# EAGLE schematic logger_SMD_0603_v1 (EAGLE 7.5.0)

## Sheet 1 of 4
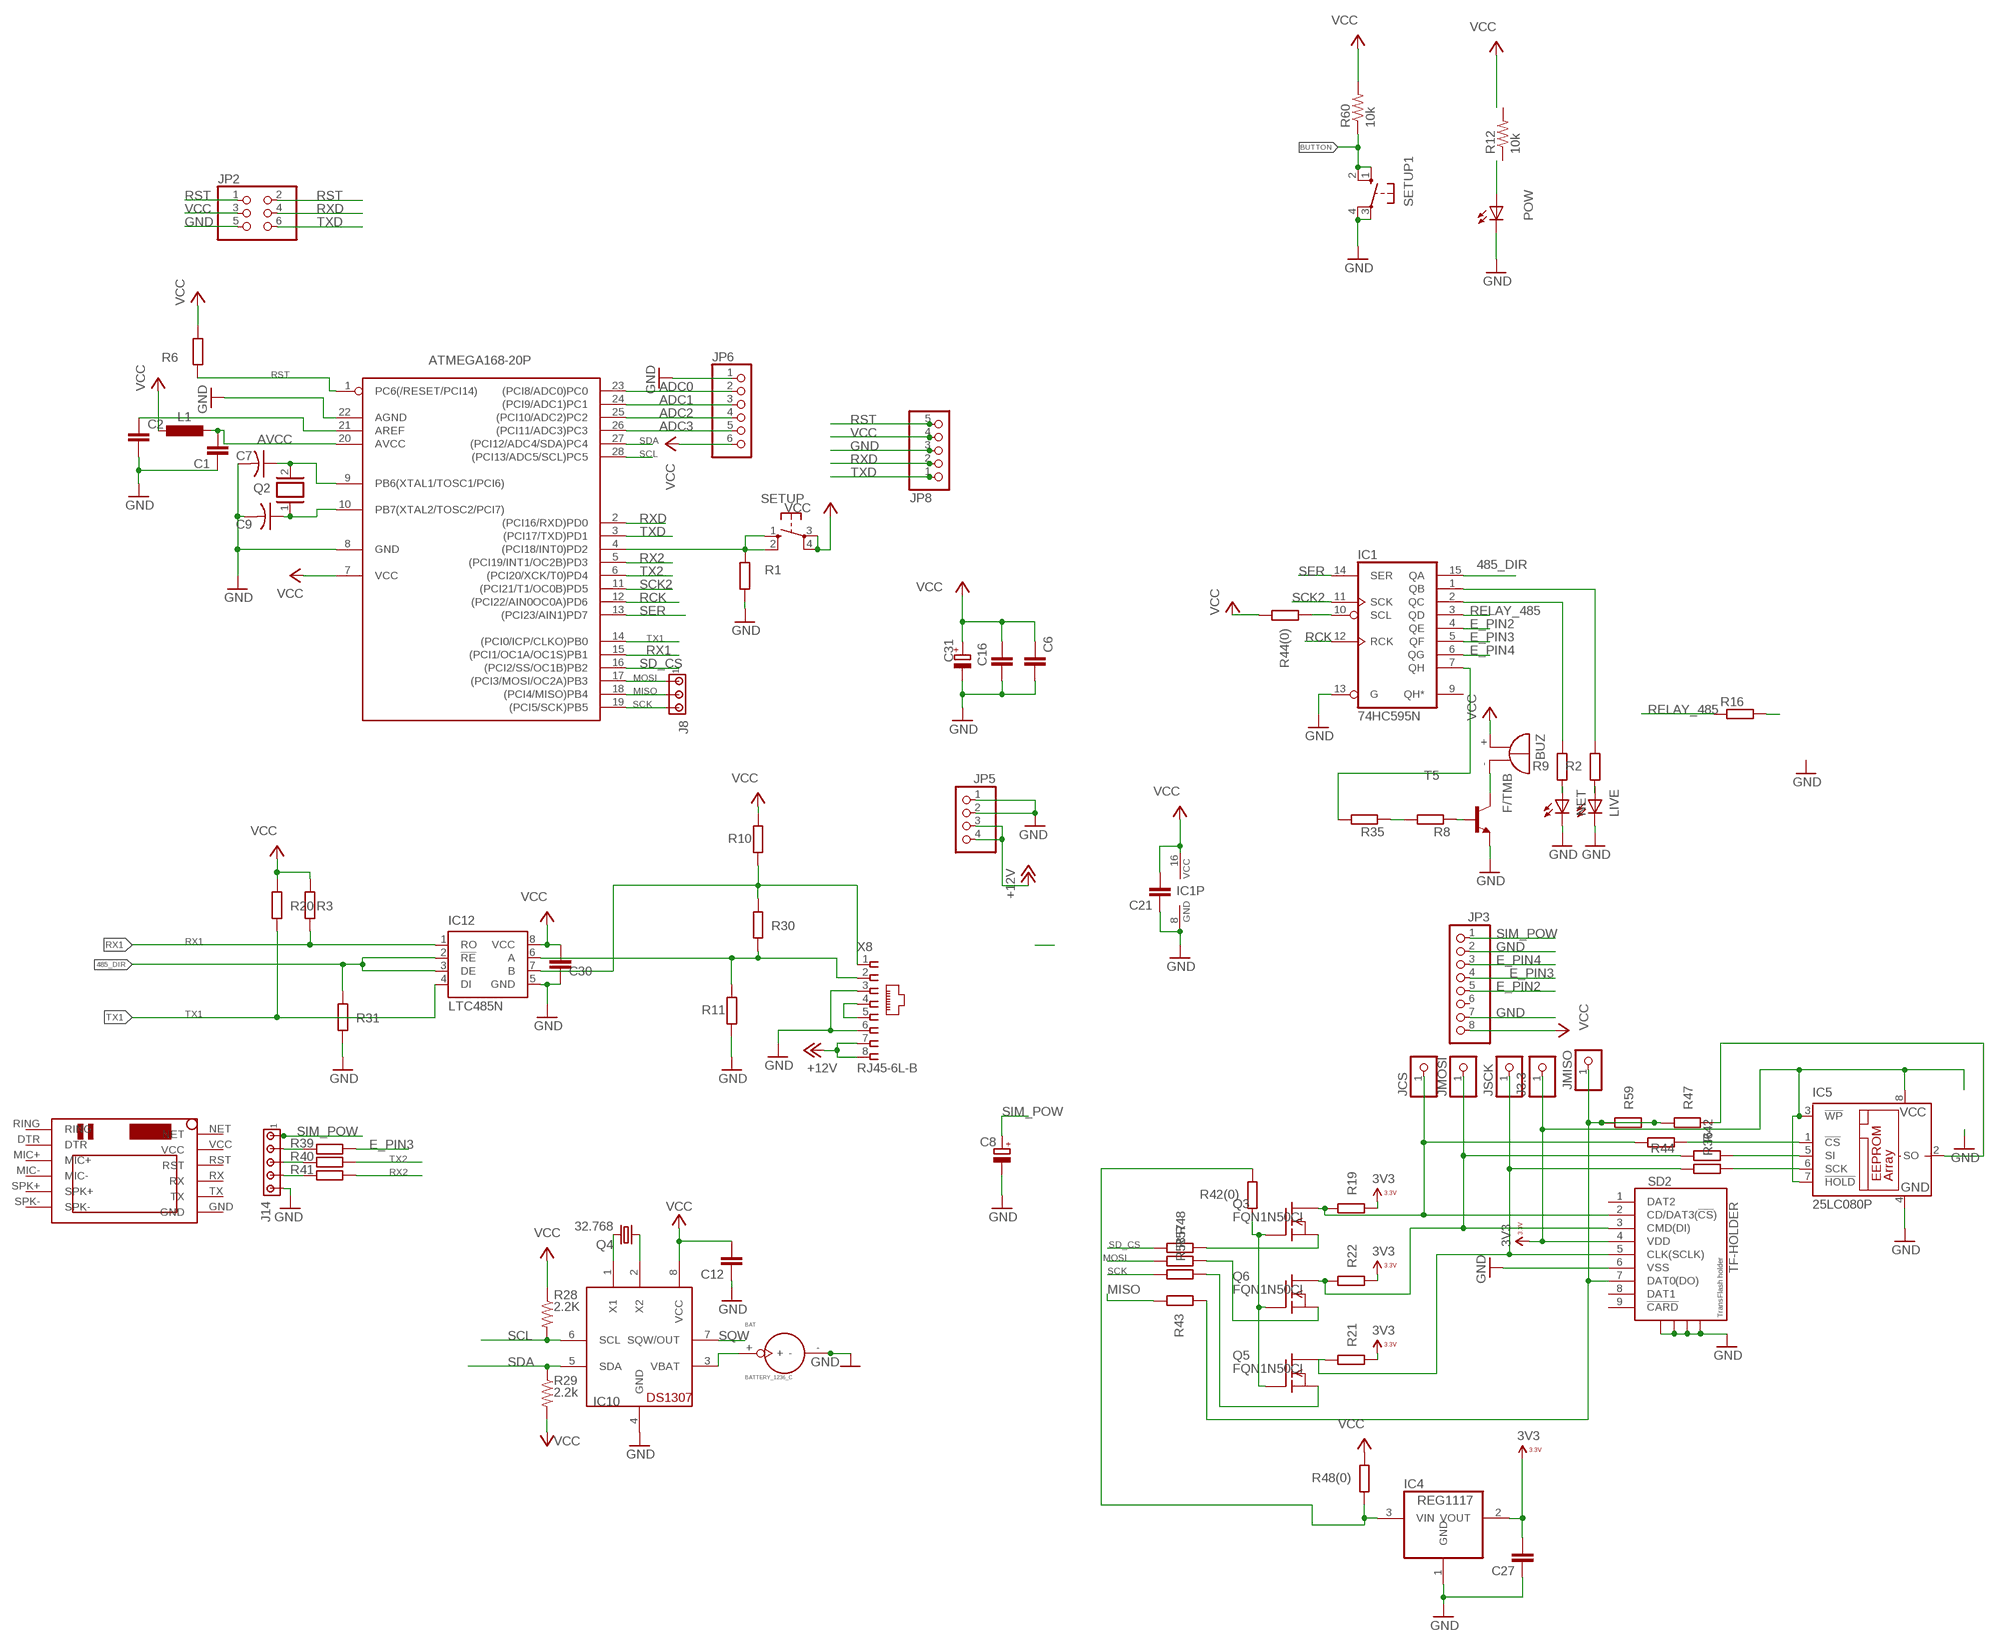
[diagram p0: schematic, sheet 1]

### Parts
BAT  BATTERY_1236_C  [BATTERY_1236_C]
BUZ  F/TMB  [F/TMB]
C1  C-EU050-024X044  [C050-024X044]
C2  C-EU025-025X050  [C025-025X050]
C6  C-EU025-025X050  [C025-025X050]
C7  C-US050-024X044  [C050-024X044]
C8  CPOL-EUE2.5-6  [E2,5-6]
C9  C-US050-024X044  [C050-024X044]
C12  C-EU075-032X103  [C075-032X103]
C16  C-EU050-024X044  [C050-024X044]
C21  C-EU050-024X044  [C050-024X044]
C27  C-EU050-024X044  [C050-024X044]
C30  C-EU050-024X044  [C050-024X044]
C31  CPOL-EUTT2D6  [TT2D6]
IC1  74HC595N  [DIL16]
IC4  REG1117  [SOT223]
IC5  25LC080P  [DIL8]
IC7  ATMEGA168-20P  [DIL28-3]
IC10  DS1307  [DIL08]
IC12  LTC485N  [DIL08]
J3.3  PINHD-1X1  [1X01]
J8  MTA03-100  [10X03MTA]
J14  MTA05-100  [10X05MTA]
JCS  PINHD-1X1  [1X01]
JMISO  PINHD-1X1  [1X01]
JMOSI  PINHD-1X1  [1X01]
JP2  PINHD-2X3  [2X03]
JP3  PINHD-1X8  [1X08]
JP5  PINHD-1X4  [1X04]
JP6  PINHD-1X6  [1X06]
JP8  PINHD-1X5/90  [1X05/90]
JSCK  PINHD-1X1  [1X01]
L1  L-EU0207/15  [0207/15]
LIVE  LED3MM  [LED3MM]
NET  LED3MM  [LED3MM]
POW  LED3MM  [LED3MM]
Q2  XTAL/S  [QS]
Q3  FQN1N50CI  [TO92-INLINE]
Q4  32.768  CRYTALTC38H  [TC38H]
Q5  FQN1N50CI  [TO92-INLINE]
Q6  FQN1N50CI  [TO92-INLINE]
R1  R-EU_0204/7  [0204/7]
R2  R-EU_0207/12  [0207/12]
R3  R-EU_0204/7  [0204/7]
R6  R-EU_0204/7  [0204/7]
R8  R-EU_0207/10  [0207/10]
R9  R-EU_0207/12  [0207/12]
R10  R-EU_0204/7  [0204/7]
R11  R-EU_0204/7  [0204/7]
R12  10k  R-US_R0805  [R0805]
R16  R-EU_0207/10  [0207/10]
R19  R-EU_0204/7  [0204/7]
R20  R-EU_0204/7  [0204/7]
R21  R-EU_0204/7  [0204/7]
R22  R-EU_0204/7  [0204/7]
R28  2.2K  R-US_0204/7  [0204/7]
R29  2.2k  R-US_0204/7  [0204/7]
R30  R-EU_0204/7  [0204/7]
R31  R-EU_0204/7  [0204/7]
R35  R-EU_0204/7  [0204/7]
R36  R-EU_0207/10  [0207/10]
R39  R-EU_0207/10  [0207/10]
R40  R-EU_0207/12  [0207/12]
R41  R-EU_0207/12  [0207/12]
R42  R-EU_0207/10  [0207/10]
R42(0)  R-EU_0207/10  [0207/10]
R43  R-EU_0204/7  [0204/7]
R44  R-EU_0207/10  [0207/10]
R44(0)  R-EU_0207/10  [0207/10]
R47  R-EU_0207/10  [0207/10]
R48  R-EU_0204/7  [0204/7]
R48(0)  R-EU_0207/10  [0207/10]
R57  R-EU_0204/7  [0204/7]
R58  R-EU_0204/7  [0204/7]
R59  R-EU_0204/7  [0204/7]
R60  10k  R-US_R0805  [R0805]
SD2  TF-HOLDER  [TF-PULL]
SETUP  10-XX  [B3F-10XX]
SETUP1  10-XX  [B3F-10XX]
T5  BC547A-NPN-TO92-CBE  [TO92-CBE]
U$1  SIM800LMODULE  [SIM800LMODULE]
X8  RJ45-6L-B  [RJ45-NO-SHIELD]

### Nets
3V3: C27.2 IC4.2(VOUT) IC5.3(!WP) IC5.7(!HOLD) IC5.8(VCC) J3.3.1 R19.2 R21.2 R22.2 SD2.4(VDD)
485_DIR: IC1.15(QA) IC12.2(!RE) IC12.3(DE) R31.1
+12V: JP5.3 JP5.4 X8.7 X8.8 ; also sheet 2
ADC0: IC7.23((PCI8/ADC0)PC0) JP6.2 ; also sheet 2
ADC1: IC7.24((PCI9/ADC1)PC1) JP6.3 ; also sheet 2
ADC2: IC7.25((PCI10/ADC2)PC2) JP6.4 ; also sheet 2
ADC3: IC7.26((PCI11/ADC3)PC3) JP6.5 ; also sheet 2
AVCC: C1.2 IC7.20(AVCC) L1.2
BUTTON: R60.1 SETUP1.1(S) SETUP1.2(S1)
E_PIN2: IC1.4(QE) JP3.5 ; also sheet 2
E_PIN3: IC1.5(QF) JP3.4 R39.1 ; also sheet 2
E_PIN4: IC1.6(QG) JP3.3 ; also sheet 2
GND: BAT.- C1.1 C2.1 C6.1 C7.2 C8.- C9.2 C12.1 C16.1 C21.1 C27.1 C30.1 C31.- IC1.8(GND) IC1.13(G) IC4.1(GND) IC5.4(GND) IC7.8(GND) IC7.22(AGND) IC10.4(GND) IC12.5(GND) J14.5 JP2.5 JP3.2 JP3.7 JP5.1 JP5.2 JP6.1 JP8.3 LIVE.K(C) NET.K(C) POW.K(C) R1.2 R11.1 R31.2 SD2.6(VSS) SD2.S1 SD2.S2 SD2.S3 SD2.S4 SETUP1.3(P) SETUP1.4(P1) T5.E X8.3 X8.6 ; also sheet 2
MISO: IC7.18((PCI4/MISO)PB4) J8.2 R43.2
MISOIHU: JMISO.1 R43.1 R47.1 R59.1 R59.2 SD2.7(DAT0(DO))
MOSI: IC7.17((PCI3/MOSI/OC2A)PB3) J8.1 Q6.3(S) R57.1 R57.2
N$1: LIVE.A R2.1
N$2: IC1.1(QB) R2.2
N$3: X8.4 X8.5
N$4: C2.2 IC7.21(AREF)
N$9: IC4.3(VIN) R42(0).2 R48(0).1
N$10: R8.1 T5.B
N$11: R16.2
N$14: NET.A R9.1
N$16: IC7.4((PCI18/INT0)PD2) R1.1 SETUP.1(S) SETUP.2(S1)
N$17: IC1.2(QC) R9.2
N$18: IC1.7(QH) R35.2
N$19: J14.2 R39.2
N$21: C7.1 IC7.9(PB6(XTAL1/TOSC1/PCI6)) Q2.2
N$22: C9.1 IC7.10(PB7(XTAL2/TOSC2/PCI7)) Q2.1
N$30: POW.A
N$33: JSCK.1 Q5.1(D) R21.1 R36.1 SD2.5(CLK(SCLK))
N$34: JMOSI.1 Q6.1(D) R22.1 R42.1 SD2.3(CMD(DI))
N$35: IC5.5(SI) R42.2
N$37: IC5.6(SCK) R36.2
N$38: J14.3 R40.2
N$44: IC5.1(!CS) R44.2
N$45: J14.4 R41.2
N$46: Q3.2(G) Q5.2(G) Q6.2(G) R42(0).1
N$47: IC1.10(SCL) R44(0).1
N$48: IC5.2(SO) R47.2
N$50: IC10.1(X1) Q4.2
N$51: IC10.2(X2) Q4.1
N$52: BAT.+ IC10.3(VBAT)
N$53: JCS.1 Q3.1(D) R19.1 R44.1 SD2.2(CD/DAT3(!CS!))
N$57: BUZ.- T5.C
N$58: R8.2 R35.1
RCK: IC1.12(RCK) IC7.12((PCI22/AIN0OC0A)PD6)
RELAY_485: IC1.3(QD) R16.1
RST: IC7.1(PC6(/RESET/PCI14)) JP2.1 JP2.2 JP8.5 R6.1
RX1: IC7.15((PCI1/OC1A/OC1S)PB1) IC12.1(RO) R3.2
RX2: IC7.5((PCI19/INT1/OC2B)PD3) R41.1
RXD: IC7.2((PCI16/RXD)PD0) JP2.4 JP8.2
SCK: IC7.19((PCI5/SCK)PB5) J8.3 Q5.3(S) R58.1 R58.2
SCK2: IC1.11(SCK) IC7.11((PCI21/T1/OC0B)PD5)
SCL: IC7.28((PCI13/ADC5/SCL)PC5) IC10.6(SCL) R28.2
SD_CS: IC7.16((PCI2/SS/OC1B)PB2) Q3.3(S) R48.1 R48.2
SDA: IC7.27((PCI12/ADC4/SDA)PC4) IC10.5(SDA) R29.1
SER: IC1.14(SER) IC7.13((PCI23/AIN1)PD7)
SIM_POW: C8.+ J14.1 JP3.1 ; also sheet 2
SQW: IC10.7(SQW/OUT)
TX1: IC7.14((PCI0/ICP/CLKO)PB0) IC12.4(DI) R20.2
TX2: IC7.6((PCI20/XCK/T0)PD4) R40.1
TX+2: IC12.7(B) R10.1 R30.1 X8.1
TX-2: IC12.6(A) R11.2 R30.2 X8.2
TXD: IC7.3((PCI17/TXD)PD1) JP2.6 JP8.1
VCC: BUZ.+ C6.2 C12.2 C16.2 C21.2 C30.2 C31.+ IC1.16(VCC) IC7.7(VCC) IC10.8(VCC) IC12.8(VCC) JP2.3 JP3.8 JP6.6 JP8.4 L1.1 R3.1 R6.2 R10.2 R20.1 R28.1 R29.2 R44(0).2 R48(0).2 R60.2 SETUP.3(P) SETUP.4(P1) ; also sheet 2
Unconnected: IC1.9(QH*) JP3.6 R12.1 R12.2 SD2.1(DAT2) SD2.8(DAT1) SD2.9(!CARD) U$1.DTR U$1.GND U$1.MIC+ U$1.MIC- U$1.NET U$1.RING U$1.RST U$1.RX U$1.SPK+ U$1.SPK- U$1.TX U$1.VCC

## Sheet 2 of 4
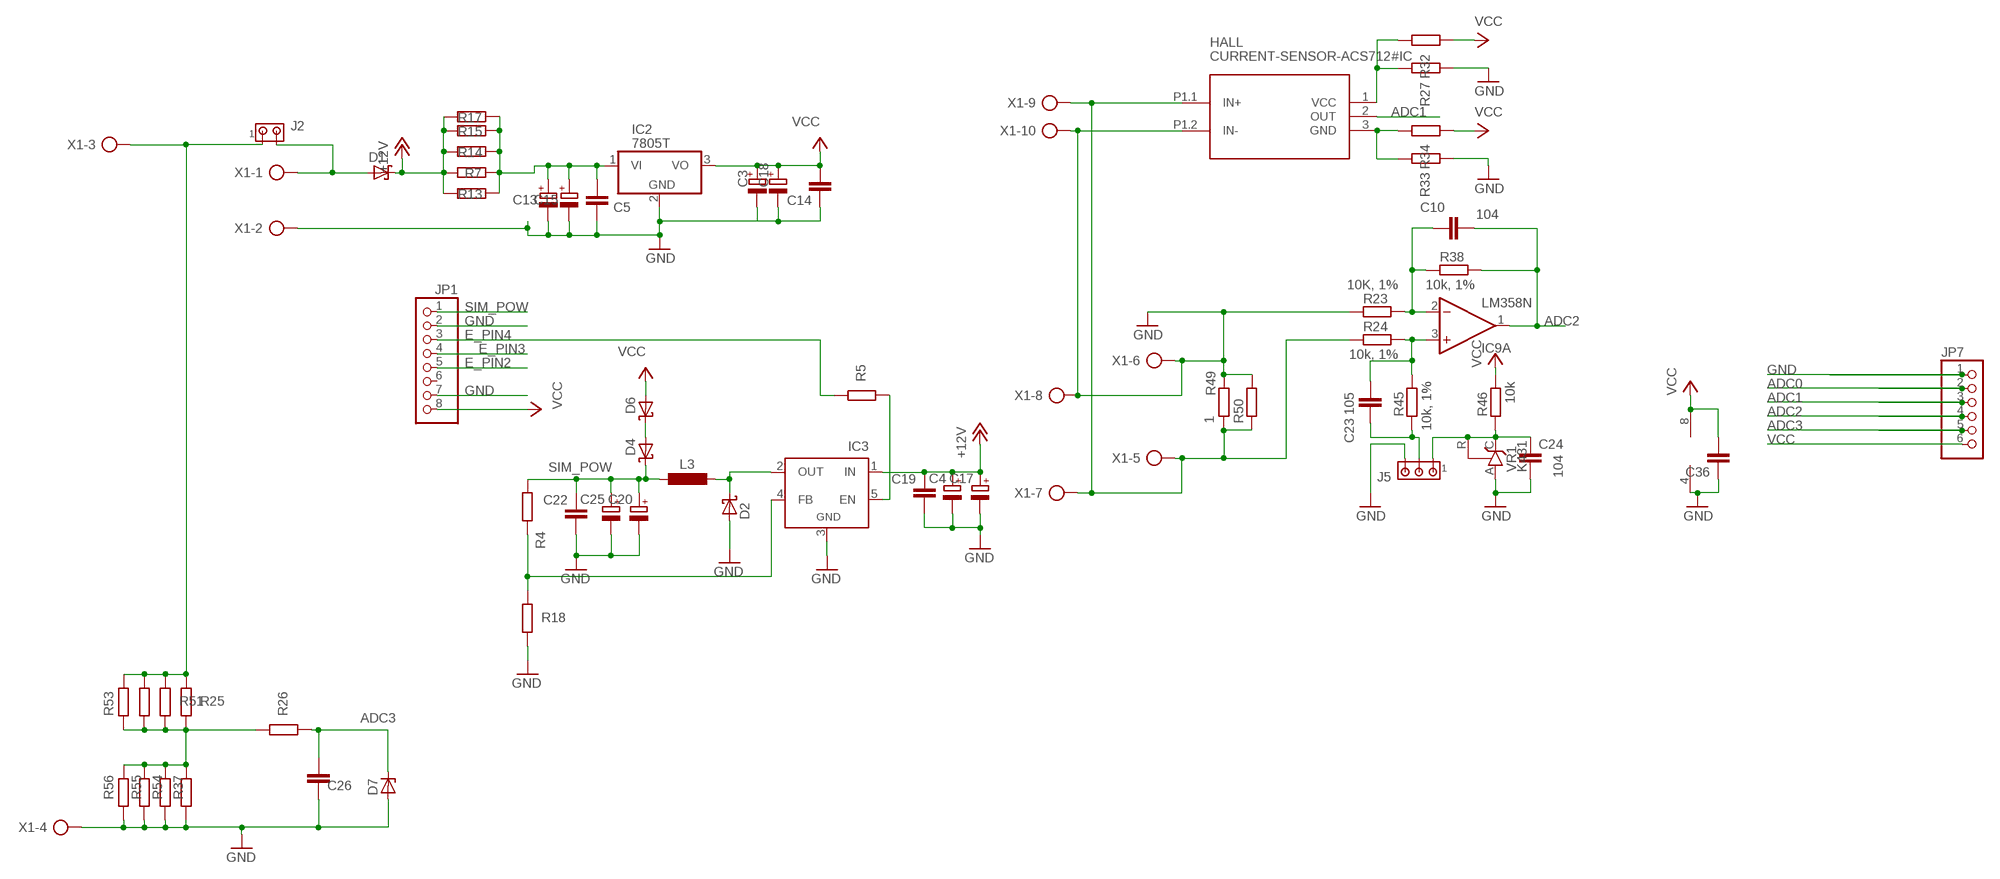
[diagram p1: schematic, sheet 2]

### Parts
C3  CPOL-EUTT2D6  [TT2D6]
C4  CPOL-EUE2.5-6  [E2,5-6]
C5  C-EU050-024X044  [C050-024X044]
C10  104  C-EU050-024X044  [C050-024X044]
C13  CPOL-EUTT2D6  [TT2D6]
C14  C-EU050-024X044  [C050-024X044]
C15  CPOL-EUTT2D6  [TT2D6]
C17  CPOL-EUE2.5-6  [E2,5-6]
C18  CPOL-EUTT2D6  [TT2D6]
C19  C-EU050-024X044  [C050-024X044]
C20  CPOL-EUE2.5-6  [E2,5-6]
C22  C-EU050-024X044  [C050-024X044]
C23  105  C-EU050-024X044  [C050-024X044]
C24  104  C-EU050-024X044  [C050-024X044]
C25  CPOL-EUE2.5-6  [E2,5-6]
C26  C-EU050-024X044  [C050-024X044]
C36  C-EU050-024X044  [C050-024X044]
D1  SCHOTTKY-DIODEDO41  [DO41-10]
D2  SCHOTTKY-DIODEDO41  [DO41-10]
D4  SCHOTTKY-DIODEDO41  [DO41-10]
D6  SCHOTTKY-DIODEDO41  [DO41-10]
D7  ZENER-DIODEDO35Z10  [DO35Z10]
HALL  CURRENT-SENSOR-ACS712#IC  [CURRENT-SENSOR-ACS712#IC]
IC2  7805T  [TO220H]
IC3  LM2596TH  [TO220-52]
IC9  LM358N  [DIL08]
J2  MTA02-100  [10X02MTA]
J5  MTA03-100  [10X03MTA]
JP1  PINHD-1X8  [1X08]
JP7  PINHD-1X6  [1X06]
L3  L-EU0207/10  [0207/10]
R4  R-EU_0204/7  [0204/7]
R5  R-EU_0207/12  [0207/12]
R7  R-EU_0204/7  [0204/7]
R13  R-EU_0204/7  [0204/7]
R14  R-EU_0204/7  [0204/7]
R15  R-EU_0204/7  [0204/7]
R17  R-EU_0204/7  [0204/7]
R18  R-EU_0204/7  [0204/7]
R23  10K, 1%  R-EU_0204/7  [0204/7]
R24  10k, 1%  R-EU_0204/7  [0204/7]
R25  R-EU_0204/7  [0204/7]
R26  R-EU_0204/7  [0204/7]
R27  R-EU_0204/7  [0204/7]
R32  R-EU_0204/7  [0204/7]
R33  R-EU_0204/7  [0204/7]
R34  R-EU_0204/7  [0204/7]
R37  R-EU_0204/7  [0204/7]
R38  10k, 1%  R-EU_0204/7  [0204/7]
R45  10k, 1%  R-EU_0204/7  [0204/7]
R46  10k  R-EU_0207/12  [0207/12]
R49  1  R-EU_MELF0207R  [MINI_MELF-0207R]
R50  R-EU_MELF0207R  [MINI_MELF-0207R]
R51  R-EU_0204/7  [0204/7]
R52  R-EU_0204/7  [0204/7]
R53  R-EU_0204/7  [0204/7]
R54  R-EU_0204/7  [0204/7]
R55  R-EU_0204/7  [0204/7]
R56  R-EU_0204/7  [0204/7]
VR1  K431  TL431CLP  [TO92-CLP]
X1  AK500/10  [AK500/10]

### Nets
+12V: C4.+ C17.+ C19.1 D1.C IC3.1(IN) R7.2 R13.2 R14.2 R15.2 R17.2 ; also sheet 1
ADC0: JP7.2 ; also sheet 1
ADC1: HALL.2(OUT) JP7.3 ; also sheet 1
ADC2: C10.1 IC9.1(A:OUT) JP7.4 R38.1 ; also sheet 1
ADC3: C26.2 D7.C JP7.5 R26.1 ; also sheet 1
CH1-I: HALL.P1.1(IN+) R24.2 R49.1 R50.1 X1.5 X1.7 X1.9
E_PIN2: JP1.5 ; also sheet 1
E_PIN3: JP1.4 ; also sheet 1
E_PIN4: JP1.3 R5.2 ; also sheet 1
GND: C3.- C4.- C5.1 C13.- C14.1 C15.- C17.- C18.- C19.2 C20.- C22.2 C24.2 C25.- C26.1 C36.1 D2.A D7.A HALL.P1.2(IN-) IC2.2(GND) IC3.3(GND) IC9.4(P:V-) J5.3 JP1.2 JP1.7 JP7.1 R18.1 R23.2 R27.1 R33.1 R37.1 R49.2 R50.2 R54.1 R55.1 R56.1 VR1.A X1.2 X1.4 X1.6 X1.8 X1.10 ; also sheet 1
N$5: D1.A J2.2 X1.1
N$7: C5.2 C13.+ C15.+ IC2.1(VI) R7.1 R13.1 R14.1 R15.1 R17.1
N$8: IC3.5(EN) R5.1
N$12: HALL.1(VCC) R27.2 R32.2
N$13: HALL.3(GND) R33.2 R34.2
N$25: R25.1 R26.2 R37.2 R51.1 R52.1 R53.1 R54.2 R55.2 R56.2
N$29: D2.C IC3.2(OUT) L3.2
N$31: IC3.4(FB) R4.1 R18.2
N$54: D4.A D6.C
N$55: C10.2 IC9.2(A:-IN) R23.1 R38.2
N$56: C24.1 J5.1 R46.2 VR1.C VR1.R
N$60: C23.1 IC9.3(A:+IN) R24.1 R45.1
N$63: C23.2 J5.2 R45.2
N$66: J2.1 R25.2 R51.2 R52.2 R53.2 X1.3
SIM_POW: C20.+ C22.1 C25.+ D4.C JP1.1 L3.1 R4.2 ; also sheet 1
VCC: C3.+ C14.2 C18.+ C36.2 D6.A IC2.3(VO) IC9.8(P:V+) JP1.8 JP7.6 R32.1 R34.1 R46.1 ; also sheet 1
Unconnected: IC9.5(B:+IN) IC9.6(B:-IN) IC9.7(B:OUT) JP1.6

## Sheet 3 of 4

## Sheet 4 of 4

## Library data of the parts
BAT = Itead_BP_110825.lbr:BATTERY_1236_C: SOC004
BUZ = buzzer:F/TMB: BUZZER Source: Buerklin; OC_FARNELL: unknown; OC_NEWARK: unknown
C1 C2 C5 C6 C10 C12 C14 C16 C21 C23 C24 C26 C27 C30 C36 = rcl:C-EU: CAPACITOR, European symbol
C3 C13 C15 C18 C31 = rcl:CPOL-EU: POLARIZED CAPACITOR, European symbol
C4 C8 C17 C20 C25 = resistor:CPOL-EU: POLARIZED CAPACITOR, European symbol
C7 C9 = adafruit:C-US: CAPACITOR, American symbol
C19 C22 = resistor:C-EU: CAPACITOR, European symbol
D1 D2 D4 D6 = adafruit:SCHOTTKY-DIODE: Schottky Diode
D7 = diode:ZENER-DIODE: Z-Diode
HALL = diy-modules:CURRENT-SENSOR-ACS712#IC: Isolated Bipolar Current Sensors based on ACS712 chip Symbol with input pins More details available here: http://embedded-lab.com/blog/a-brief-overview-of-allegro-acs712-current-sensor-part-1/ Click here to find device on ebay.com <http://www.ebay.com/sch/acs712+module> Note: There are many available versions with different pinout. Please check before use
IC1 = 74xx-eu:74*595: 8-bit SHIFT REGISTER, output latch
IC2 = linear:78*: Positive VOLTAGE REGULATOR Source: http://cache.national.com/ds/LM/LM78L05.pdf http://www.fairchildsemi.com/ds/LM/LM7805.pdf
IC3 = linear:LM2596T: STEP-DOWN VOLTAGE REGULATOR
IC4 = burr-brown:REG1117: 800mA and 1A Low Dropout (LDO) Positive Regulator 1.8V, 2.5V, 2.85V, 3.3V, 5V, and Adj; MPN: REG1117; OC_FARNELL: 1097566; OC_NEWARK: 14P6981
IC5 = microchip:25*: Serial EEPROM 4K/ 8K , SPI bus; MF: MICROCHIP; MPN: 25LC080/P; OC_FARNELL: 1556143; OC_NEWARK: 92C7440
IC7 = adafruit:ATMEGA168*P: MICROCONTROLLER 16 kBytes FLASH 1 kBytes SRAM 512 Bytes EEPROM USART 8-channel 10 bit ADC
IC9 = linear:LM358: OP AMP also LM158; LM258; LM2904 Source: http://cache.national.com/ds/LM/LM158.pdf
IC10 = adafruit:DS1307: DS1307 Real time clock (RTC) with battery backup ability. Talk to it via i2c
IC12 = linear-technology:LTC485: Low Power RS485 Interface Transceiver Source: http://www.linear.com/pc/downloadDocument.do?navId=H0,C1,C1007,C1017,P2064,D1718; OC_FARNELL: unknown; OC_NEWARK: unknown
J2 = con-amp:MTA02-100: AMP connector
J3.3 JCS JMISO JMOSI JSCK = adafruit:PINHD-1X1: Pin header 1x1 for 0.1" spacing With round pins
J5 J8 = con-amp:MTA03-100: AMP connector
J14 = con-amp:MTA05-100: AMP connector
JP1 JP3 = pinhead:PINHD-1X8: PIN HEADER
JP2 = pinhead:PINHD-2X3: PIN HEADER
JP5 = pinhead:PINHD-1X4: PIN HEADER
JP6 JP7 = adafruit:PINHD-1X6: PIN HEADER
JP8 = pinhead:PINHD-1X5: PIN HEADER
L1 L3 = rcl:L-EU: INDUCTOR, European symbol
LIVE NET POW = led:LED: LED OSRAM: - CHIPLED LG R971, LG N971, LY N971, LG Q971, LY Q971, LO R971, LY R971 LH N974, LH R974 LS Q976, LO Q976, LY Q976 LO Q996 - Hyper CHIPLED LW Q18S LB Q993, LB Q99A, LB R99A - SideLED LS A670, LO A670, LY A670, LG A670, LP A670 LB A673, LV A673, LT A673, LW A673 LH A674 LY A675 LS A676, LA A676, LO A676, LY A676, LW A676 LS A679, LY A679, LG A679 - Hyper Micro SIDELED® LS Y876, LA Y876, LO Y876, LY Y876 LT Y87S - SmartLED LW L88C, LW L88S LB L89C, LB L89S, LG L890 LS L89K, LO L89K, LY L89K LS L896, LA L896, LO L896, LY L896 - TOPLED LS T670, LO T670, LY T670, LG T670, LP T670 LSG T670, LSP T670, LSY T670, LOP T670, LYG T670 LG T671, LOG T671, LSG T671 LB T673, LV T673, LT T673, LW T673 LH T674 LS T676, LA T676, LO T676, LY T676, LB T676, LH T676, LSB T676, LW T676 LB T67C, LV T67C, LT T67C, LS T67K, LO T67K, LY T67K, LW E67C LS E67B, LA E67B, LO E67B, LY E67B, LB E67C, LV E67C, LT E67C LW T67C LS T679, LY T679, LG T679 LS T770, LO T770, LY T770, LG T770, LP T770 LB T773, LV T773, LT T773, LW T773 LH T774 LS E675, LA E675, LY E675, LS T675 LS T776, LA T776, LO T776, LY T776, LB T776 LHGB T686 LT T68C, LB T68C - Hyper Mini TOPLED® LB M676 - Mini TOPLED Santana® LG M470 LS M47K, LO M47K, LY M47K Source: http://www.osram.convergy.de LUXEON: - LUMILED® LXK2-PW12-R00, LXK2-PW12-S00, LXK2-PW14-U00, LXK2-PW14-V00 LXK2-PM12-R00, LXK2-PM12-S00, LXK2-PM14-U00 LXK2-PE12-Q00, LXK2-PE12-R00, LXK2-PE12-S00, LXK2-PE14-T00, LXK2-PE14-U00 LXK2-PB12-K00, LXK2-PB12-L00, LXK2-PB12-M00, LXK2-PB14-N00, LXK2-PB14-P00, LXK2-PB14-Q00 LXK2-PR12-L00, LXK2-PR12-M00, LXK2-PR14-Q00, LXK2-PR14-R00 LXK2-PD12-Q00, LXK2-PD12-R00, LXK2-PD12-S00 LXK2-PH12-R00, LXK2-PH12-S00 LXK2-PL12-P00, LXK2-PL12-Q00, LXK2-PL12-R00 Source: www.luxeon.com KINGBRIGHT: KA-3528ASYC Source: www.kingbright.com
Q2 = special:XTAL/S: CRYSTAL
Q3 Q5 Q6 = adafruit:FQN1N50C: N-Channel Enhancement MOSFET 500V, 0.4A, 6.0 Ohm
Q4 = crystal:CRYTAL: CRYSTAL
R1-R11 R13-R15 R17-R27 R30-R42 R42(0) R43 R44 R44(0) R45-R48 R48(0) R51-R59 = rcl:R-EU_: RESISTOR, European symbol
R12 R60 = resistor:R-US_: RESISTOR, American symbol
R16 R49 R50 = resistor:R-EU_: RESISTOR, European symbol
R28 R29 = adafruit:R-US_: RESISTOR, American symbol
SD2 = sd-mmc:TF-HOLDER: TF / Micro SD socket is PUSH-PUSH type, the card can be pushed into and auto locked and pushed out by simply press the card. Surface Mounting type.
SETUP SETUP1 = switch-omron:10-XX: OMRON SWITCH; MPN: B3F-1000; OC_FARNELL: 176432; OC_NEWARK: 36M3542
T5 = transistor:*-NPN-: NPN Transistror BF959 corrected 2008.03.06
U$1 = SIM800LMODULE:SIM800LMODULE: SIM800L Module
VR1 = v-reg:TL431CLP: VOLTAGE REGULATOR
X1 = con-ptr500:AK500/10: CONNECTOR; OC_FARNELL: unknown; OC_NEWARK: unknown
X8 = con-tycoelectronics:RJ45: CORCOM Modular RJ Jacks No Shield Source: www.tycoelectronics.com .. ENG_DS_1654001_1099_RJ_L_0507.pdf; MPN: RJ45-6L-B; OC_FARNELL: unknown; OC_NEWARK: 16R6090